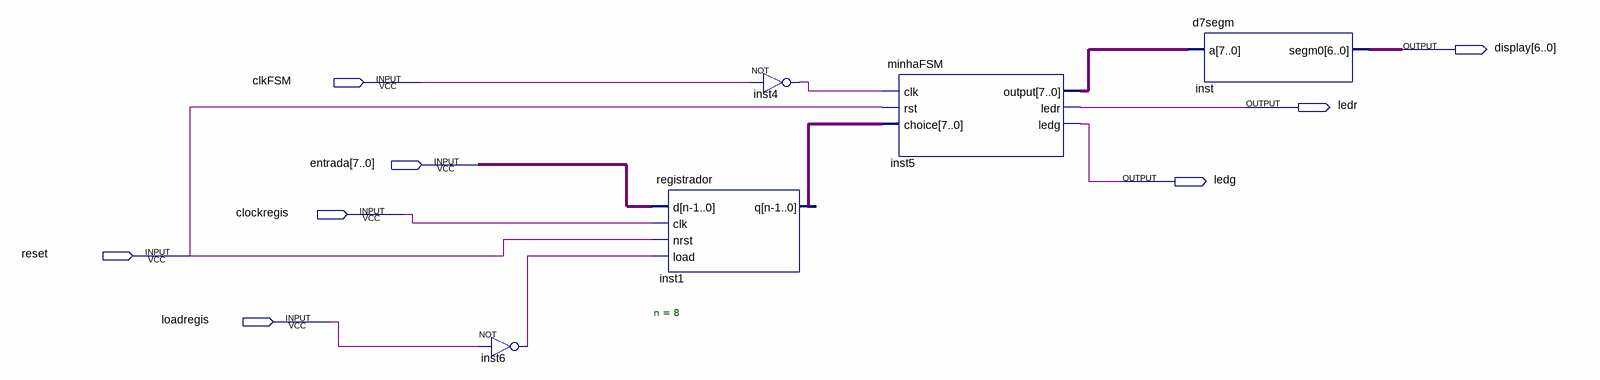
[diagram p0: schematic sheet]
// Quartus schematic REC_PONT_FLUT.bdf as structural Verilog: 5 symbols, 8 pins
module REC_PONT_FLUT (
  input  clkFSM,
  input  [7:0] entrada,
  input  clockregis,
  input  reset,
  input  loadregis,
  output [6:0] display,
  output ledr,
  output ledg
);

  wire inst4_out, inst6_out;
  wire [7:0] inst1_q, inst5_output;

  not inst6 (inst6_out, loadregis);
  registrador #(.n(8)) inst1 (.d(entrada), .clk(clockregis), .nrst(reset), .load(inst6_out), .q(inst1_q));
  not inst4 (inst4_out, clkFSM);
  minhaFSM inst5 (.clk(inst4_out), .rst(reset), .choice(inst1_q), .\output (inst5_output), .ledr(ledr), .ledg(ledg));
  d7segm inst (.a(inst5_output), .segm0(display));
endmodule
